# Altium schematic sheet 2_Power.schdoc
size 307 x 218 mm; Symbol: Sheet-Symbol_A4; Device: Sheet-Symbol_A4; Company: 嘉立创EDA; Drawed: Fukui (Daniel) Yang; Version: V1.0; Page Size: A4; @Project Name: OptoGrid_V0.05; @Page Count: 2; @Update Date: 2025-09-04; @Create Date: 2025-07-05; @Schematic Name: OptoGrid_Main_V0.05; @Page No: 2; @Page Name: Power; Title Block Position: 3; Width: 1170; Height: 825; Region Start: 1; X Region Count: 6; Y Region Count: 4; Blade Width: 10; @Board Name: OptoGrid_Main_V0.05; @Create Time: 17:38:21; @Update Time: 09:45:07
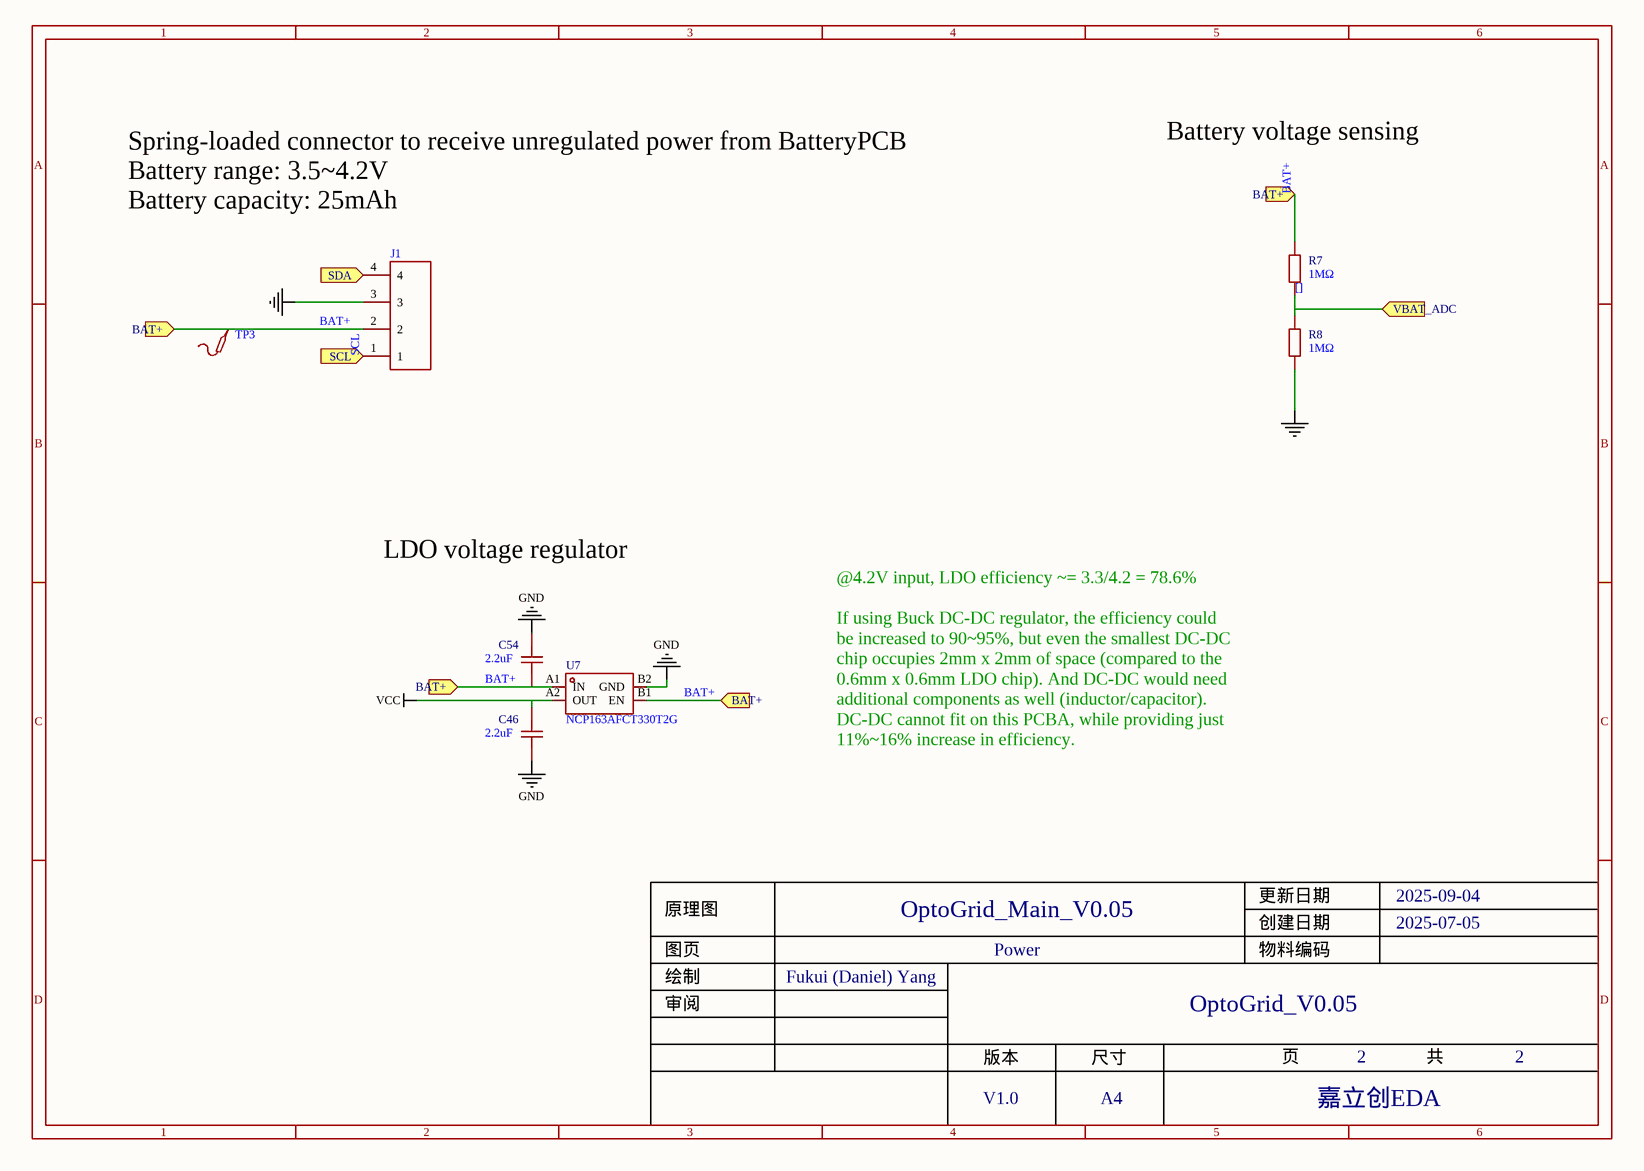
[diagram p0: 2_Power.schdoc]

## Parts
C46  2.2uF  [C0201]
C54  2.2uF  [C0201]
J1  (no value)  [811-22-004-30-002101]
R7  1MΩ  [R0201]
R8  1MΩ  [R0201]
TP3  (no value)  [Test-Point-0.5mm]
U7  NCP163AFCT330T2G  [WLCSP-4_L0.6-W0.6-P0.35-R2-C2-TL]

## Ports
BAT+ (in), SCL (in), SDA (in), VBAT_ADC (in)

## Nets
GND: C46.1 C54.2 J1.3 R8.1 U7.B2(GND)
VCC: C46.2 U7.A2(OUT)
[]: R7.1 R8.2 ; port VBAT_ADC
BAT+: C54.1 J1.2 R7.2 TP3.1 U7.A1(IN) U7.B1(EN) ; port BAT+
SCL: J1.1 ; port SCL
SDA: J1.4 ; port SDA

## Notes on the sheet
- (near TP3) Spring-loaded connector to receive unregulated power from BatteryPCB
  Battery range: 3.5~4.2V
  Battery capacity: 25mAh
- Battery voltage sensing
- LDO voltage regulator
- @4.2V input, LDO efficiency ~= 3.3/4.2 = 78.6%
  If using Buck DC-DC regulator, the efficiency could
  be increased to 90~95%, but even the smallest DC-DC
  chip occupies 2mm x 2mm of space (compared to the
  0.6mm x 0.6mm LDO chip). And DC-DC would need
  additional components as well (inductor/capacitor).
  DC-DC cannot fit on this PCBA, while providing just
  11%~16% increase in efficiency.
- 1
- 2
- 3
- 4
- 5
- 6
- A
- B
- C
- 原理图
- OptoGrid_Main_V0.05
- 创建日期
- 更新日期
- 2025-09-04
- 2025-07-05
- 绘制
- 图页
- Fukui (Daniel) Yang
- Power
- 物料编码
- D
- 审阅
- 版本
- 尺寸
- OptoGrid_V0.05
- 页
- 共
- V1.0
- A4
- 嘉立创EDA

## Library data of the parts
C46 C54 = GRM033R61A225KE47D: Manufacturer: muRata(村田); Add into BOM: yes; Tolerance: ±10%; Voltage Rated: 10V; Temperature Coefficient: X5R; Symbol: GRM033R61A225KE47D; Device: GRM033R61A225KE47D; LCSC Part Name: 2.2uF ±10% 10V; Supplier Part: C335106; Manufacturer Part: GRM033R61A225KE47D; Supplier Footprint: 0201; JLCPCB Part Class: 扩展库; Datasheet: https://atta.szlcsc.com/upload/public/pdf/source/20200305/C490387_23319AE8C154DEB24C505E6C82A8106A.pdf; Supplier: LCSC; Convert to PCB: yes; Value: 2.2uF
J1 = 811-22-004-30-002101: Manufacturer: Mill-Max; Add into BOM: yes; Symbol: 811-22-004-30-002101; Device: 811-22-004-30-002101; Convert to PCB: yes; Supplier: LC; Supplier Part: C29643123; Manufacturer Part: 811-22-004-30-002101
R7 R8 = RC0201FR-071ML: Manufacturer: YAGEO(国巨); Add into BOM: yes; Tolerance: ±1%; Power(Watts): 50mW; Overload Voltage (Max): 25V; Temperature Coefficient: ±200ppm/℃; Symbol: RC0201FR-071ML; Device: RC0201FR-071ML; LCSC Part Name: 厚膜电阻 1MΩ ±1% 50mW; Supplier Part: C295786; Manufacturer Part: RC0201FR-071ML; Supplier Footprint: 0201; JLCPCB Part Class: 扩展库; Datasheet: https://atta.szlcsc.com/upload/public/pdf/source/20181009/C309620_DA5935B6E1D48212CB7A533FE518B3C2.pdf; Supplier: LCSC; Convert to PCB: yes; Type: 厚膜电阻; Value: 1MΩ; Operating Temperature Range: -55℃~+125℃
TP3 = Test-Point: Add into BOM: yes; Symbol: Test-Point; Device: Test-Point; Convert to PCB: yes
U7 = NCP163AFCT330T2G: Manufacturer: onsemi(安森美); Add into BOM: yes; Symbol: NCP163AFCT330T2G; Device: NCP163AFCT330T2G; LCSC Part Name: LDO 稳压器，250 mA，超高 PSRR，超低噪音; Supplier Part: C603648; Manufacturer Part: NCP163AFCT330T2G; Supplier Footprint: WLCSP-4; JLCPCB Part Class: 扩展库; Datasheet: https://atta.szlcsc.com/upload/public/pdf/source/20200927/C603657_74821F5CD7CAE943477E5F5DC4975E14.pdf; Supplier: LCSC; Convert to PCB: yes; Output Type: -